# EAGLE design interstage_miniSMD (EAGLE 9.2.2)
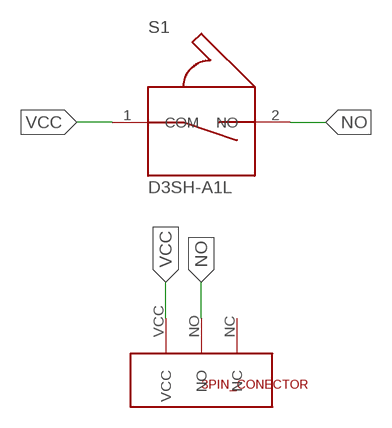
[diagram p0: schematic, sheet 1]

## Parts
S1  D3SH-A1L  [SW_D3SH-A1L]
U$1  CONECTOR  [CONECTOR]

## Nets
NO: S1.2(NO) U$1.NO
VCC: S1.1(COM) U$1.VCC
Unconnected: U$1.NC

## Library data of the parts
S1 = D3SH-A1L:D3SH-A1L: Switch Detector N.O. SPST Lever J-Bend 0.001A 5VDC SMD T/R; DESCRIPTION: Switch SPST-NO Surface Mount, Right Angle; MF: Omron; MP: D3SH-A1L; PACKAGE: None
U$1 = conector:CONECTOR

## Board
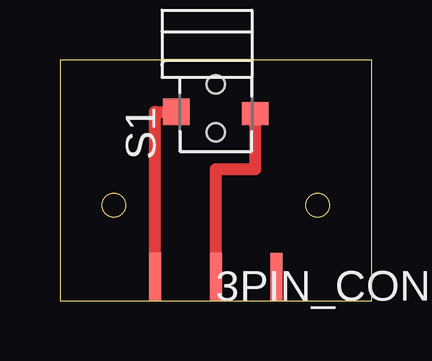
[diagram p1: board, top side]

Size 13 x 10.06 mm. Coordinates in mm from the lower left corner, seen from the top.
Outline: 0,0 13,0 13,10.06 0,10.06 0,0
Outline: circle at 2.25,4 radius 0.5
Outline: circle at 10.75,4 radius 0.5
Copper layers (1*16): Top 0.035mm / dielectric 1.5mm / Bottom 0.035mm
Design rules "default *": minimum track width 6mil, minimum drill 0.35mm, track to track 6mil, track to pad 6mil, pad to pad 6mil, via to via 6mil, smd to smd 6mil, copper to edge 0mil, drill to drill 6mil, minimum pad ring 10mil, minimum via ring 8mil, stop-mask expansion 4mil, vias tented up to drill 0mil, thermal gap 10mil

### Footprints (pad centres in the part's own frame; a part is rotated, then mirrored left to right if it is on the bottom)
SW_D3SH-A1L = smd 1.1 x 1.1: 1 -1.65,0 | smd 1.1 x 0.95: 2 1.65,-0.075 | hole 0.75: 0,1.15; 0,-0.85
CONECTOR = smd 0.5 x 2: NC 2.54,1; NO 0,1; VCC -2.54,1

### Placement (x,y rotation side)
S1  6.5,7.89 0 top
U$1  6.5,0 0 top

### Tracks (layer width: path | path; a pad name or v marks a point on that pad's centre or on a via)
NO
  Top 0.5: S1.2 8.15,5.5 6.5,5.5 U$1.NO
VCC
  Top 0.5: S1.1 3.96,7.89 U$1.VCC